# EAGLE design vacuumsensor (EAGLE 6.4)
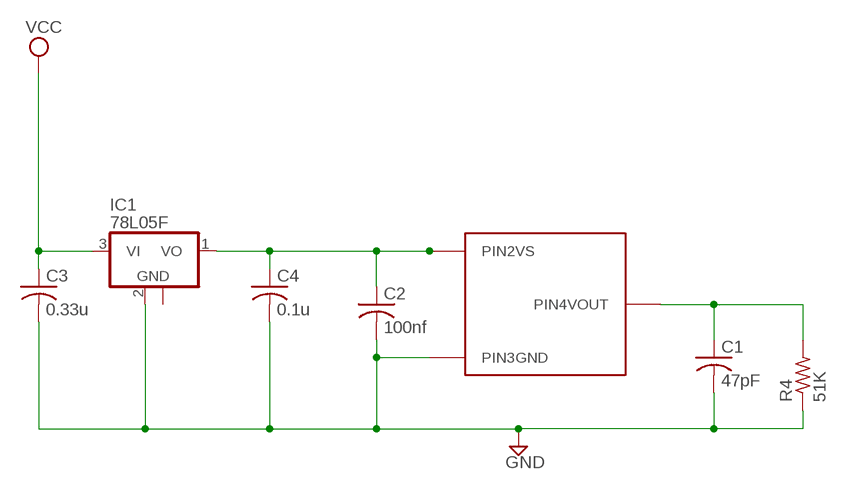
[diagram p0: schematic, sheet 1]

## Parts
C1  47pF  C-US050-024X044  [C050-024X044]
C2  100nf  C-US050-024X044  [C050-024X044]
C3  0.33u  C-US050-024X044  [C050-024X044]
C4  0.1u  C-US050-024X044  [C050-024X044]
IC1  78L05F  [SOT89]
R4  51K  R-US_0309/12  [0309/12]
U$1  MPXV6115V6U  [482A]

## Nets
GND: C1.2 C2.2 C3.2 C4.2 IC1.2(GND) R4.1 U$1.P$3(PIN3GND)
N$2: C1.1 R4.2 U$1.P$4(PIN4VOUT)
N$4: C2.1 C4.1 IC1.1(VO) U$1.P$2(PIN2VS)
VCC: C3.1 IC1.3(VI)
Unconnected: IC1.2@1(GND)

## Library data of the parts
C1-C4 = adafruit:C-US: CAPACITOR, American symbol
IC1 = linear:78L*: POSITOIV-VOLTAGE REGULATORS Output up to 100 mA Source: http://focus.ti.com/lit/ds/symlink/ua78l05.pdf
R4 = adafruit:R-US_: RESISTOR, American symbol
U$1 = mylibrary:MPXV6115V6U: MPXV6115V6U vacuum sensor

## Board
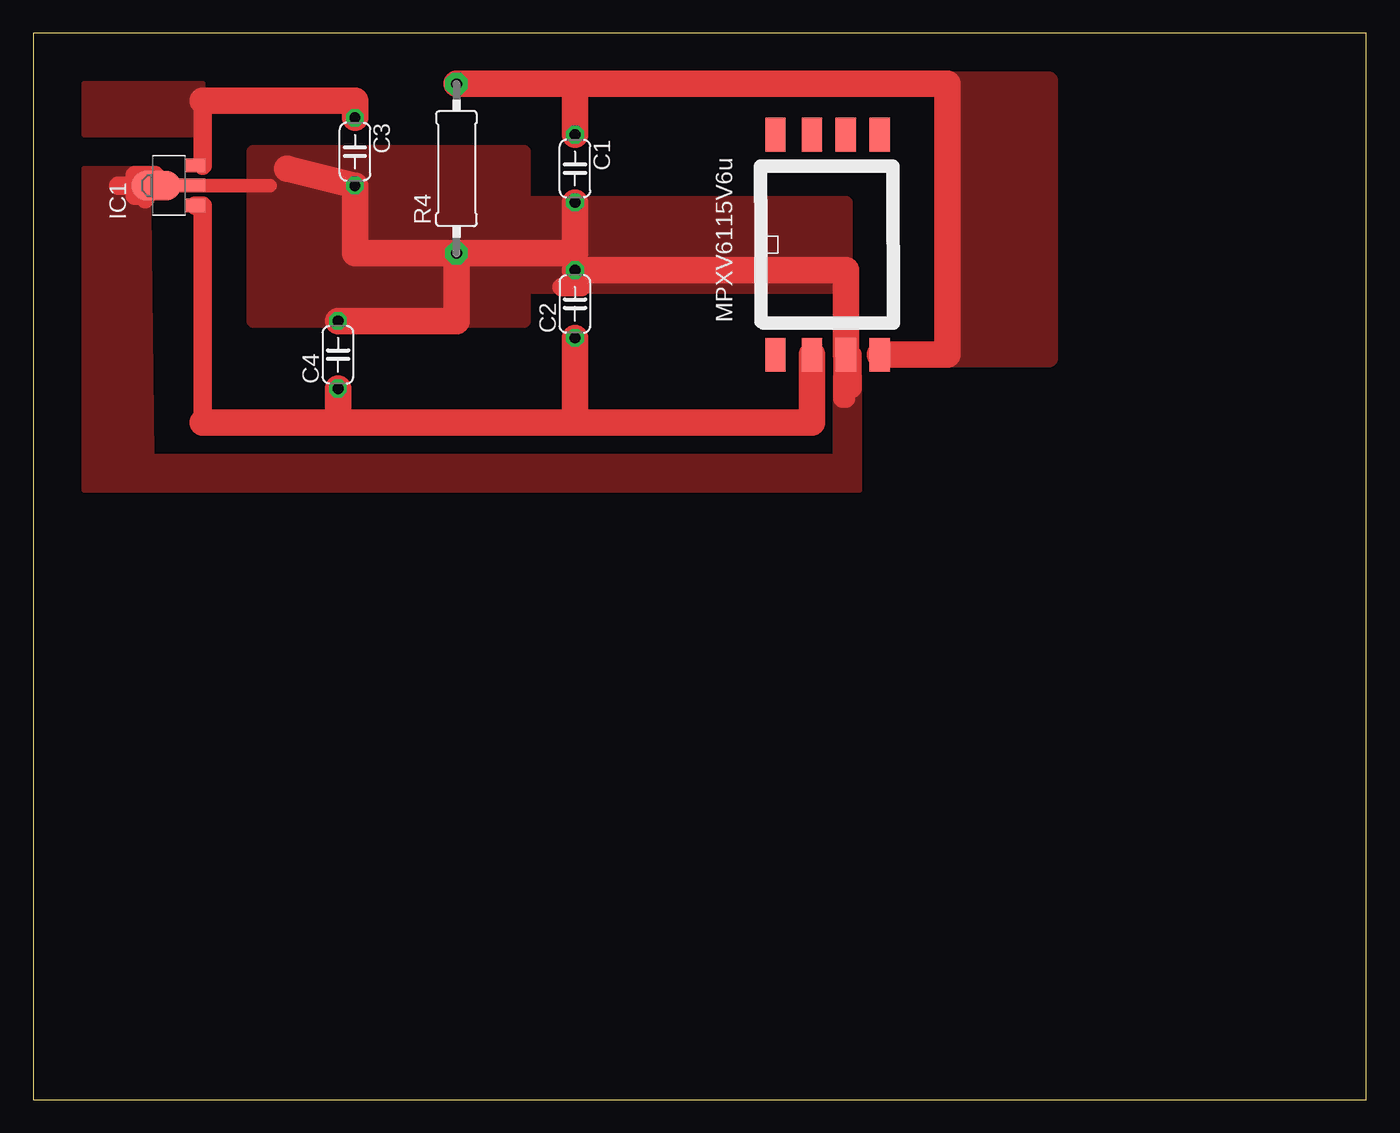
[diagram p1: board, top side]

Size 100 x 80 mm. Coordinates in mm from the lower left corner, seen from the top.
Outline: 0,0 100,0 100,80 0,80 0,0
Copper layers (1*16): Top 0.035mm / dielectric 1.5mm / Bottom 0.035mm
Design rules "default": minimum track width 10mil, minimum drill 24mil, track to track 8mil, track to pad 8mil, pad to pad 8mil, via to via 8mil, smd to smd 8mil, copper to edge 40mil, drill to drill 8mil, minimum pad ring 10mil, minimum via ring 8mil, stop-mask expansion 4mil, vias tented up to drill 0mil, thermal gap 10mil

### Footprints (pad centres in the part's own frame; a part is rotated, then mirrored left to right if it is on the bottom)
C050-024X044 = drill 0.813 octagon: 1 -2.54,0; 2 2.54,0
SOT89 = smd 1 x 1.5: 1 -1.499,-1.981; 3 1.499,-1.981 | smd 1 x 2: 2 0,-1.727 | smd 2.2 x 3.7: 2@1 0,0.94
0309/12 = drill 0.813 pad 1.676 octagon: 1 -6.35,0; 2 6.35,0
482A = smd 2.54 x 1.524: P$1 -5.08,4.01; P$2 -5.08,1.27; P$3 -5.08,-1.27; P$4 -5.08,-3.81; P$5 11.43,4.01; P$6 11.43,1.27; P$7 11.43,-1.27; P$8 11.43,-3.81

### Placement (x,y rotation side)
C1  40.64,69.85 270 top
C2  40.64,59.69 90 top
C3  24.13,71.12 270 top
C4  22.86,55.88 90 top
IC1  10.16,68.58 90 top
R4  31.75,69.85 90 top
U$1  59.69,60.96 90 top

### Tracks (layer width: path | path; a pad name or v marks a point on that pad's centre or on a via)
GND
  Top 0.254: C2.2 40.64,63.5
  Top 1: IC1.2 17.78,68.58
  Top 1.4: 60.96,56.13 60.96,52.58 60.71,52.58 60.71,55.88 61.47,55.88 61.47,53.34 | 6.35,68.58 9.14,68.58 9.14,69.34 7.62,69.34 7.62,67.82 8.38,67.82 8.38,67.56 | 39.62,60.96 41.15,60.96
  Top 2: U$1.P$3 60.96,56.13 60.96,62.23 C2.2 | C1.2 40.64,63.5 R4.1 | C4.2 31.75,58.42 R4.1 | R4.1 24.13,63.5 C3.2 19.05,69.85
  pour Top: 16.51,71.12 16.51,58.42 36.83,58.42 36.83,71.12
  pour Top: 36.83,67.31 60.96,67.31 60.96,60.96 36.83,60.96
  pour Top: 60.2,55.63 60.2,48.26 8.89,48.26 8.64,69.85 3.81,69.85 3.81,45.72 61.98,45.72 61.98,55.63
N$2
  Top 2: R4.2 40.64,76.2 | 40.64,76.2 C1.1 | 40.64,76.2 68.58,76.2 68.58,55.88 U$1.P$4
  pour Top: 68.58,55.63 76.2,55.63 76.2,55.88 76.2,76.45 68.58,76.45 68.58,76.2
N$4
  Top 1.4: IC1.1 12.7,67.08 12.7,50.8
  Top 2: U$1.P$2 58.42,50.8 40.64,50.8 | 22.86,50.8 40.64,50.8 | 40.64,50.8 C2.1 | 22.86,50.8 12.7,50.8 | C4.1 22.86,50.8
VCC
  Top 1: IC1.3 12.7,70.08
  Top 1.4: 12.7,70.08 12.7,74.93
  Top 2: 12.7,74.93 24.13,74.93 C3.1
  pour Top: 12.7,74.93 3.81,74.93 3.81,76.2 12.7,76.2
  pour Top: 3.81,74.93 3.81,72.39 12.7,72.39 12.7,74.93